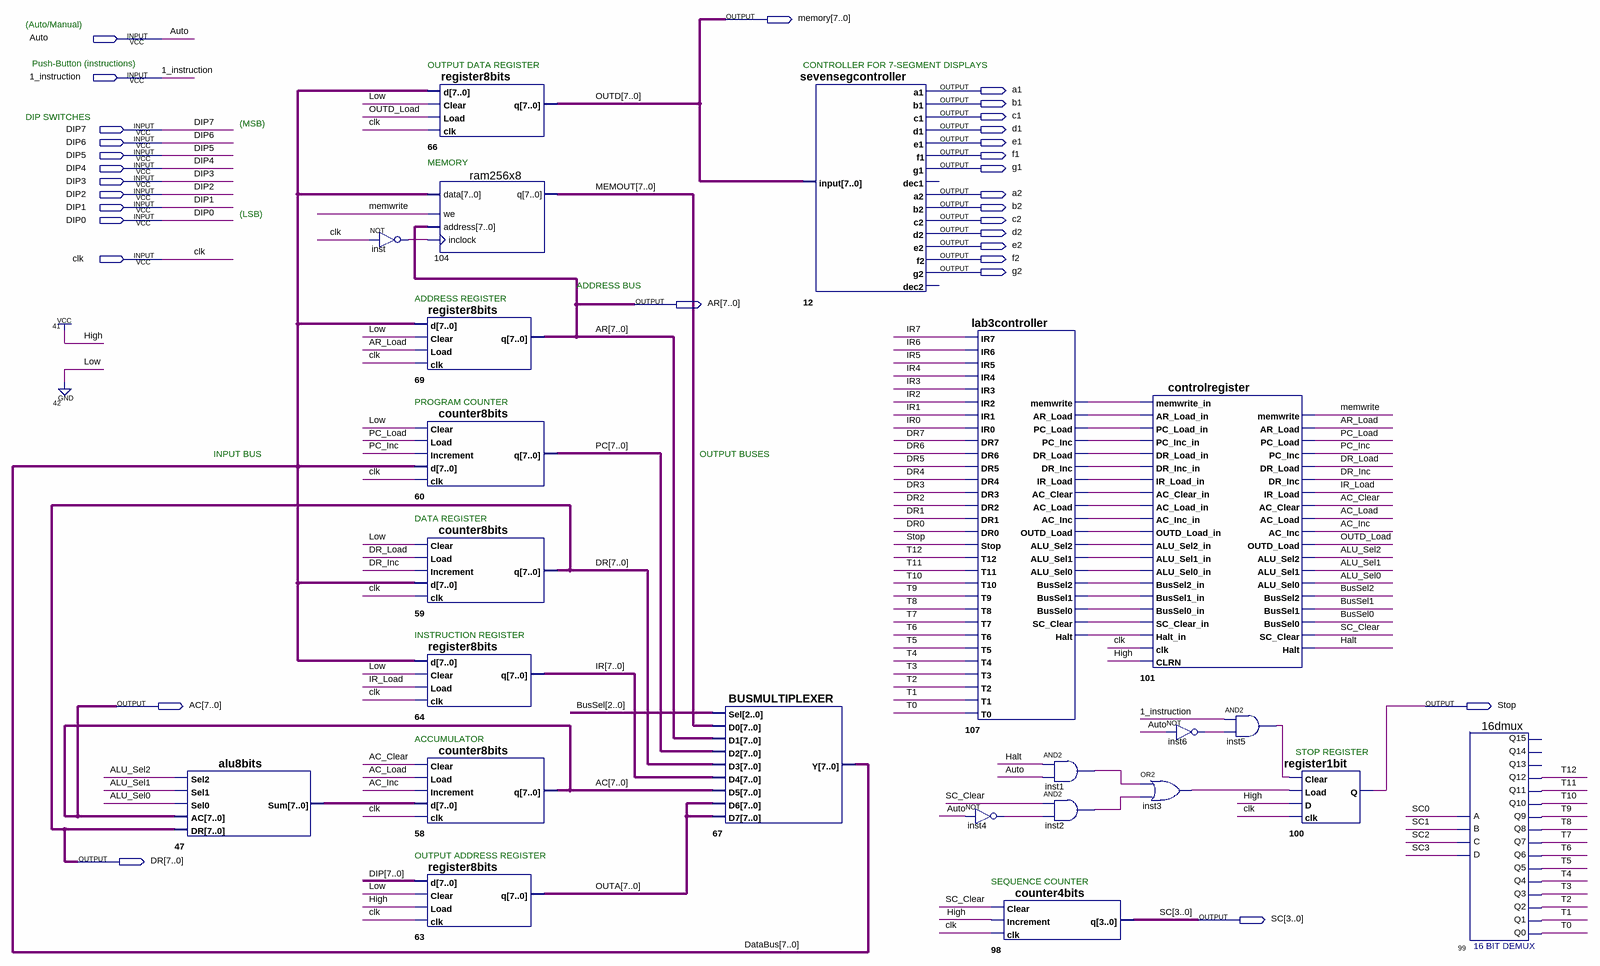
[diagram p0: schematic sheet]
// Quartus schematic lab3top.bdf as structural Verilog: 23 symbols, 31 pins
module lab3top (
  input  Auto,
  input  \1_instruction ,
  input  DIP7,
  input  DIP6,
  input  DIP5,
  input  DIP4,
  input  DIP3,
  input  DIP2,
  input  DIP1,
  input  DIP0,
  input  clk,
  output [7:0] memory,
  output a1,
  output b1,
  output c1,
  output d1,
  output e1,
  output f1,
  output g1,
  output a2,
  output b2,
  output c2,
  output d2,
  output e2,
  output f2,
  output g2,
  output [7:0] AR,
  output [7:0] AC,
  output Stop,
  output [7:0] DR,
  output [3:0] SC
);

  wire AC_Clear, AC_Inc, AC_Load, ALU_Sel0, ALU_Sel1, ALU_Sel2, AR_Load, DR_Inc, DR_Load, Halt, inst1_out,
       inst2_out, inst3_out, inst4_out, inst5_out, inst6_out, inst_out, IR_Load, memwrite, n107_ac_clear,
       n107_ac_inc, n107_ac_load, n107_alu_sel0, n107_alu_sel1, n107_alu_sel2, n107_ar_load, n107_bussel0,
       n107_bussel1, n107_bussel2, n107_dr_inc, n107_dr_load, n107_halt, n107_ir_load, n107_memwrite,
       n107_outd_load, n107_pc_inc, n107_pc_load, n107_sc_clear, OUTD_Load, PC_Inc, PC_Load, SC_Clear, T0,
       T1, T2, T3, T4, T5, T6, T7, T8, T9, T10, T11, T12;
  wire [2:0] BusSel;
  wire [7:0] DataBus, IR, MEMOUT, n47_sum, OUTA, PC;

  alu8bits u_47 (.Sel2(ALU_Sel2), .Sel1(ALU_Sel1), .Sel0(ALU_Sel0), .AC(AC), .DR(DR), .Sum(n47_sum));
  not inst (inst_out, clk);
  register8bits u_66 (.d(DataBus), .Clear(1'b0), .Load(OUTD_Load), .clk(clk), .q(memory));
  ram256x8 u_104 (.data(DataBus), .we(memwrite), .address(AR), .inclock(inst_out), .q(MEMOUT));
  register8bits u_69 (.d(DataBus), .Clear(1'b0), .Load(AR_Load), .clk(clk), .q(AR));
  counter8bits u_60 (.Clear(1'b0), .Load(PC_Load), .Increment(PC_Inc), .d(DataBus), .clk(clk), .q(PC));
  counter8bits u_59 (.Clear(1'b0), .Load(DR_Load), .Increment(DR_Inc), .d(DataBus), .clk(clk), .q(DR));
  register8bits u_64 (.d(DataBus), .Clear(1'b0), .Load(IR_Load), .clk(clk), .q(IR));
  counter8bits u_58 (.Clear(AC_Clear), .Load(AC_Load), .Increment(AC_Inc), .d(n47_sum), .clk(clk), .q(AC));
  register8bits u_63 (
    .d({DIP7, DIP6, DIP5, DIP4, DIP3, DIP2, DIP1, DIP0}), .Clear(1'b0), .Load(1'b1), .clk(clk), .q(OUTA));
  BUSMULTIPLEXER u_67 (
    .Sel(BusSel), .D0(MEMOUT), .D1(AR), .D2(PC), .D3(DR), .D4(IR), .D5(AC), .D6(OUTA), .D7(OUTA), .Y(DataBus));
  sevensegcontroller u_12 (
    .\input (memory), .a1(a1), .b1(b1), .c1(c1), .d1(d1), .e1(e1), .f1(f1), .g1(g1), .a2(a2), .b2(b2),
    .c2(c2), .d2(d2), .e2(e2), .f2(f2), .g2(g2));  // open: dec1, dec2
  lab3controller u_107 (
    .IR7(IR[7]), .IR6(IR[6]), .IR5(IR[5]), .IR4(IR[4]), .IR3(IR[3]), .IR2(IR[2]), .IR1(IR[1]), .IR0(IR[0]),
    .DR7(DR[7]), .DR6(DR[6]), .DR5(DR[5]), .DR4(DR[4]), .DR3(DR[3]), .DR2(DR[2]), .DR1(DR[1]), .DR0(DR[0]),
    .Stop(Stop), .T12(T12), .T11(T11), .T10(T10), .T9(T9), .T8(T8), .T7(T7), .T6(T6), .T5(T5), .T4(T4),
    .T3(T3), .T2(T2), .T1(T1), .T0(T0), .memwrite(n107_memwrite), .AR_Load(n107_ar_load),
    .PC_Load(n107_pc_load), .PC_Inc(n107_pc_inc), .DR_Load(n107_dr_load), .DR_Inc(n107_dr_inc),
    .IR_Load(n107_ir_load), .AC_Clear(n107_ac_clear), .AC_Load(n107_ac_load), .AC_Inc(n107_ac_inc),
    .OUTD_Load(n107_outd_load), .ALU_Sel2(n107_alu_sel2), .ALU_Sel1(n107_alu_sel1), .ALU_Sel0(n107_alu_sel0),
    .BusSel2(n107_bussel2), .BusSel1(n107_bussel1), .BusSel0(n107_bussel0), .SC_Clear(n107_sc_clear),
    .Halt(n107_halt));
  not inst4 (inst4_out, Auto);
  counter4bits u_98 (.Clear(SC_Clear), .Increment(1'b1), .clk(clk), .q(SC));
  and inst1 (inst1_out, Halt, Auto);
  and inst2 (inst2_out, SC_Clear, inst4_out);
  controlregister u_101 (
    .memwrite_in(n107_memwrite), .AR_Load_in(n107_ar_load), .PC_Load_in(n107_pc_load),
    .PC_Inc_in(n107_pc_inc), .DR_Load_in(n107_dr_load), .DR_Inc_in(n107_dr_inc), .IR_Load_in(n107_ir_load),
    .AC_Clear_in(n107_ac_clear), .AC_Load_in(n107_ac_load), .AC_Inc_in(n107_ac_inc),
    .OUTD_Load_in(n107_outd_load), .ALU_Sel2_in(n107_alu_sel2), .ALU_Sel1_in(n107_alu_sel1),
    .ALU_Sel0_in(n107_alu_sel0), .BusSel2_in(n107_bussel2), .BusSel1_in(n107_bussel1),
    .BusSel0_in(n107_bussel0), .SC_Clear_in(n107_sc_clear), .Halt_in(n107_halt), .clk(clk), .CLRN(1'b1),
    .memwrite(memwrite), .AR_Load(AR_Load), .PC_Load(PC_Load), .PC_Inc(PC_Inc), .DR_Load(DR_Load),
    .DR_Inc(DR_Inc), .IR_Load(IR_Load), .AC_Clear(AC_Clear), .AC_Load(AC_Load), .AC_Inc(AC_Inc),
    .OUTD_Load(OUTD_Load), .ALU_Sel2(ALU_Sel2), .ALU_Sel1(ALU_Sel1), .ALU_Sel0(ALU_Sel0),
    .BusSel2(BusSel[2]), .BusSel1(BusSel[1]), .BusSel0(BusSel[0]), .SC_Clear(SC_Clear), .Halt(Halt));
  not inst6 (inst6_out, Auto);
  or inst3 (inst3_out, inst1_out, inst2_out);
  and inst5 (inst5_out, \1_instruction , inst6_out);
  register1bit u_100 (.Clear(inst5_out), .Load(inst3_out), .D(1'b1), .clk(clk), .Q(Stop));
  \16dmux  u_99 (
    .A(SC[0]), .B(SC[1]), .C(SC[2]), .D(SC[3]), .Q12(T12), .Q11(T11), .Q9(T9), .Q8(T8), .Q7(T7), .Q10(T10),
    .Q6(T6), .Q5(T5), .Q4(T4), .Q3(T3), .Q2(T2), .Q1(T1), .Q0(T0));  // open: Q14, Q13, Q15

  // Other names for the same wires on the sheet: OUTD[7:0] = memory

  // Notes on the sheet:
  //   (Auto/Manual)
  //   Push-Button (instructions)
  //   OUTPUT DATA REGISTER
  //   CONTROLLER FOR 7-SEGMENT DISPLAYS
  //   DIP SWITCHES
  //   (MSB)
  //   MEMORY
  //   (LSB)
  //   ADDRESS BUS
  //   ADDRESS REGISTER
  //   PROGRAM COUNTER
  //   INPUT BUS
  //   OUTPUT BUSES
  //   DATA REGISTER
  //   INSTRUCTION REGISTER
  //   ACCUMULATOR
  //   STOP REGISTER
  //   OUTPUT ADDRESS REGISTER
  //   SEQUENCE COUNTER
endmodule
